# Altium schematic sheet TopLevel.SchDoc: MSE - CSYEI : MiniBalance Top Level
size A4; Author: Guillaume Volery; SheetNumber: 1; SheetTotal: 8; SVN: OUI; Version: 2.1; NoProject: <no>; TitleProject: <project>; PageSetup: Record=PageOptions|CenterHorizontal=True|CenterVertical=True|PrintScale=0.97|XCorrection=1.00|YCorrection=1.00|PrintKind=0|BorderSize=5000000|LeftOffset=0|BottomOffset=0|Orientation=2|PaperLength=1000|PaperWidth=1000|Scale=100|PaperSource=7|PrintQuality=-3|MediaType=1|DitherType=10|PrintScaleMode=1|PaperKind=A4 (210 x 297 mm)|PaperIndex=9
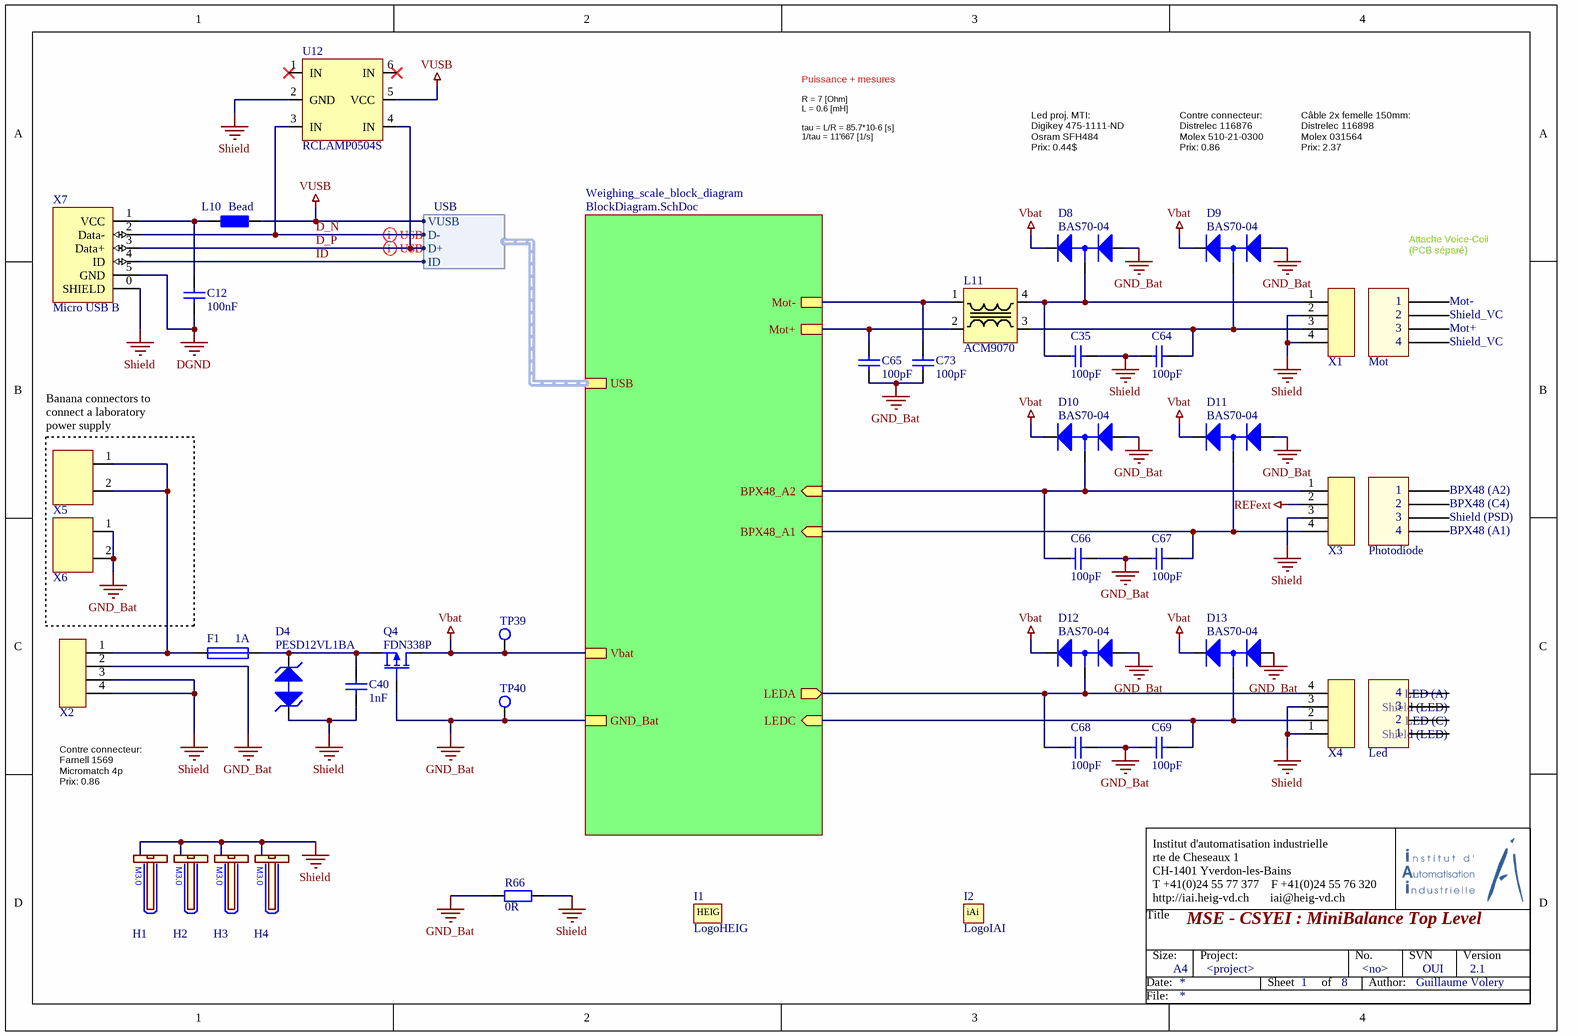
[diagram p0: TopLevel.SchDoc]

## Parts
C12  100nF  [CAPC2012N]
C35  100pF  [CAPC2012N]
C40  1nF  [CAPC2012N]
C64  100pF  [CAPC2012N]
C65  100pF  [CAPC2012N]
C66  100pF  [CAPC2012N]
C67  100pF  [CAPC2012N]
C68  100pF  [CAPC2012N]
C69  100pF  [CAPC2012N]
C73  100pF  [CAPC2012N]
D4  PESD12VL1BA  [SOD323]
D8  BAS70-04  [SOT23-3N]
D9  BAS70-04  [SOT23-3N]
D10  BAS70-04  [SOT23-3N]
D11  BAS70-04  [SOT23-3N]
D12  BAS70-04  [SOT23-3N]
D13  BAS70-04  [SOT23-3N]
F1  1A  [RESC2012N]
H1  Mhole M3  [MHOLE_M3.0]  (value not drawn)
H2  Mhole M3  [MHOLE_M3.0]  (value not drawn)
H3  Mhole M3  [MHOLE_M3.0]  (value not drawn)
H4  Mhole M3  [MHOLE_M3.0]  (value not drawn)
I1  LogoHEIG  [LOGO HEIG-VD_TOP/solder TOP]
I2  LogoIAI  [LOGO_IAI_TOP]
L10  Bead  [RESC2012N]
L11  ACM9070  [ACM9070]
Q4  FDN338P  [SOT23-3N]
R66  0R  [RESC2012N]
TP39  TP  [Testpoint]  (value not drawn)
TP40  TP  [Testpoint]  (value not drawn)
U12  RCLAMP0504S  [SOT-23-6]
X1  MicroMatch4p  [MicroMatch4p]  (value not drawn)
X2  MicroMatch4p  [MicroMatch4p]  (value not drawn)
X3  MicroMatch4p  [MicroMatch4p]  (value not drawn)
X4  MicroMatch4p  [MicroMatch4p]  (value not drawn)
X5  Fiche Banane Rouge 4mm  [BANANE]  (value not drawn)
X6  Fiche Banane Noire 4mm  [BANANE]  (value not drawn)
X7  Micro USB B  [Micro_USB_ZX62-B-5PA(33)]

## Sub-sheets
Weighing_scale_block_diagram = BlockDiagram.SchDoc: LEDA (out), LEDC (in), BPX48_A2 (in), BPX48_A1 (in), Mot-, Mot+, Vbat, GND_Bat, USB (harness USB)

## Harnesses
USB: VUSB, D-, D+, ID

## Nets
DGND: C12.1 X7.5(GND)
GND_Bat: C65.1 C66.2 C67.1 C68.2 C69.1 C73.1 D8.1(A) D9.1(A) D10.1(A) D11.1(A) D12.1(A) D13.1(A) Q4.1(G) R66.1 TP40.1 X2.2 X6.1 X6.2 ; sheet Weighing_scale_block_diagram/GND_Bat
REFext: X3.2
Shield: C35.2 C40.1 C64.1 D4.1(K1) H1.1(S) H2.1(S) H3.1(S) H4.1(S) R66.2 U12.2(GND) X1.2 X1.4 X2.3 X2.4 X3.3 X4.1 X4.3 X7.0(SHIELD)
Vbat: D8.2(K) D9.2(K) D10.2(K) D11.2(K) D12.2(K) D13.2(K) Q4.3(D) TP39.1 ; sheet Weighing_scale_block_diagram/Vbat
VUSB: L10.2 U12.5(VCC) ; sheet Weighing_scale_block_diagram/USB.VUSB
D_N: U12.3(IN) X7.2(Data-) ; sheet Weighing_scale_block_diagram/USB.D-
D_P: U12.4(IN) X7.3(Data+) ; sheet Weighing_scale_block_diagram/USB.D+
ID: X7.4(ID) ; sheet Weighing_scale_block_diagram/USB.ID
NetC12_2: C12.2 L10.1 X7.1(VCC)
NetC35_1: C35.1 D8.3(A/K) L11.4 X1.1
NetC40_2: C40.2 D4.2(K2) F1.2 Q4.2(S)
NetC64_2: C64.2 D9.3(A/K) L11.3 X1.3
NetC65_2: C65.2 L11.2 ; sheet Weighing_scale_block_diagram/Mot+
NetC66_1: C66.1 D10.3(A/K) X3.1 ; sheet Weighing_scale_block_diagram/BPX48_A2
NetC67_2: C67.2 D11.3(A/K) X3.4 ; sheet Weighing_scale_block_diagram/BPX48_A1
NetC68_1: C68.1 D12.3(A/K) X4.4 ; sheet Weighing_scale_block_diagram/LEDA
NetC69_2: C69.2 D13.3(A/K) X4.2 ; sheet Weighing_scale_block_diagram/LEDC
NetC73_2: C73.2 L11.1 ; sheet Weighing_scale_block_diagram/Mot-
NetF1_1: F1.1 X2.1 X5.1 X5.2

Not connected (* = marked no-connect by the designer): U12 1(IN)* 6(IN)*

## Layout directives
differential pair: D_N, D_P

## Notes on the sheet
- Puissance + mesures
- Led proj. MTI:
  Digikey 475-1111-ND
  Osram SFH484
  Prix: 0.44$
- R = 7 [Ohm]
  L = 0.6 [mH]
  tau = L/R = 85.7*10-6 [s]
  1/tau = 11'667 [1/s]
- Contre connecteur:
  Distrelec 116876
  Molex 510-21-0300
  Prix: 0.86
- Câble 2x femelle 150mm:
  Distrelec 116898
  Molex 031564
  Prix: 2.37
- 1
- Attache Voice-Coil
  (PCB séparé)
- Mot-
- (near X1) Mot
- 2
- 3
- 4
- Shield_VC
- Mot+
- (near X5) Banana connectors to connect a laboratory power supply
- BPX48 (A2)
- BPX48 (C4)
- Shield (PSD)
- (near X3) Photodiode
- BPX48 (A1)
- LED (C)
- Shield (LED)
- LED (A)
- (near X4) Led
- Contre connecteur:
  Farnell 1569
  Micromatch 4p
  Prix: 0.86
- Title
- Institut d'automatisation industrielle
  rte de Cheseaux 1
  CH-1401 Yverdon-les-Bains
  T +41(0)24 55 77 377    F +41(0)24 55 76 320
  http://iai.heig-vd.ch       iai@heig-vd.ch
- Date:
- Size:
- A4
- Project:
- Sheet
- of
- No.
- Author:
- SVN
- Version
- File:
- (in symbol LogoHEIG) HEIG
- (in symbol LogoIAI) iAi
- (in symbol M3) M3.0

## Library data of the parts
C12 = Cap_100nF: Capacitor; Value: 100nF; Supplier 1: Digi-Key; Supplier Part Number 1: 478-1395-1-ND
C35 C64-C69 C73 = Cap_100pF: Capacitor; Value: 100pF; Supplier 1: Digi-Key; Supplier Part Number 1: 399-1122-1-ND
C40 = Cap_1nF: Capacitor; Value: 1nF; Supplier 1: Digi-Key; Supplier Part Number 1: 311-1127-1-ND
F1 = Fuse_1A: MFU0805FF01000P100; Supplier 1: Digi-Key; Supplier Part Number 1: MFU08051.00CT-ND; Value: 1A
H1-H4 = M3: Value: Mhole M3
Q4 = FDN338P: MOSFet P; Supplier 1: Digi-Key; Supplier Part Number 1: FDN338PCT-ND; Value: FDN338P
R66 = Res_0R: Resistor; Value: 0R; Supplier 1: Digi-Key; Supplier Part Number 1: 311-0.0ARCT-ND
TP39 TP40 = TP: =Value; Supplier 1: Digi-Key; Supplier Part Number 1: 36-5006-ND
U12 = RCLAMP0504S.TCT: Supplier 1: Digi-Key; Supplier Part Number 1: RCLAMP0504SCT-ND
X7 = Micro_USB_ZX62-B-5PA(33): Supplier 1: Digi-Key; Supplier Part Number 1: H125270CT-ND
D4 = PESD12VL1BA: Supplier 1: Digi-Key; Supplier Part Number 1: 568-4022-1-ND
D8-D13 = BAS70-04: Supplier 1: Digi-Key; Supplier Part Number 1: BAS70-04-FDICT-ND
L10 = Bead: Value: Bead; Supplier 1: Digi-Key; Supplier Part Number 1: 240-2399-1-ND
L11 = ACM9070: Supplier 1: Digi-Key; Supplier Part Number 1: 445-2216-1-ND
X1-X4 = MicroMatch4p: Supplier 1: Digi-Key; Supplier Part Number 1: A107022CT-ND
X5 = Fiche Banane Rouge 4mm: Supplier 1: Farnell; Supplier Part Number 1: 1698982
X6 = Fiche Banane Noire 4mm: Supplier 1: Farnell; Supplier Part Number 1: 1698983